# EAGLE schematic arduino_wiring (EAGLE 9.5.2)
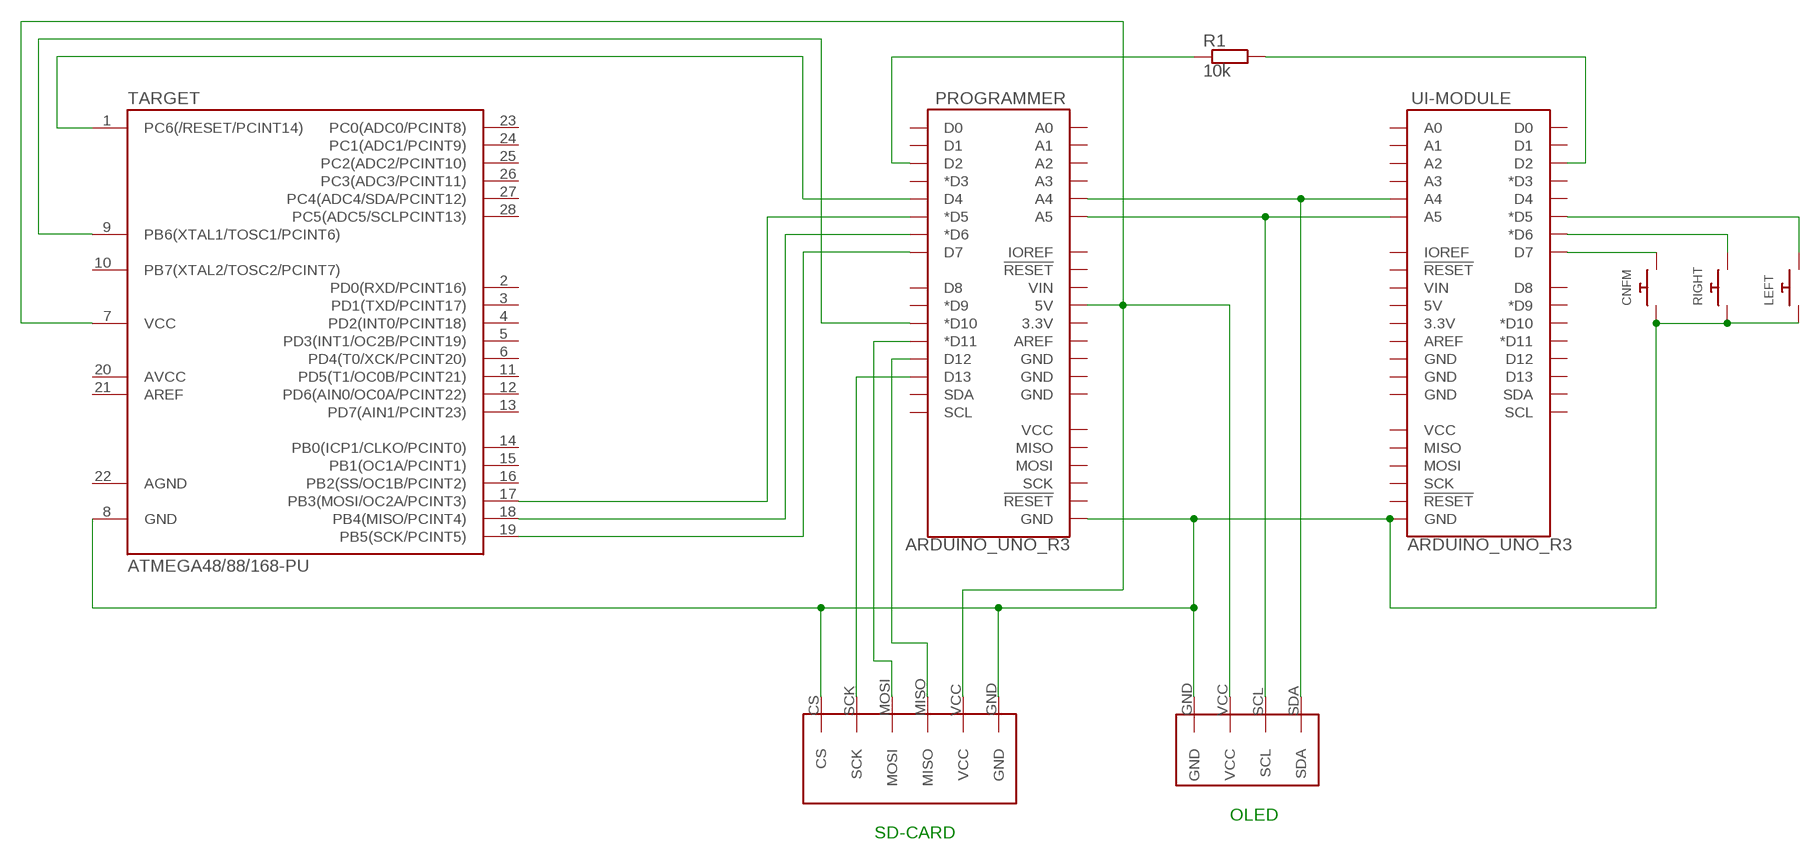
[diagram p0: schematic, sheet 1]

## Parts
CNFM  SWITCH_PUSHBUTTONSOFTTOUCHSMD_SJ  [PUSHBUTTON_SMD_SJ]
LEFT  SWITCH_PUSHBUTTONSOFTTOUCHSMD_SJ  [PUSHBUTTON_SMD_SJ]
PROGRAMMER  ARDUINO_UNO_R3  [ARDUINO_R3]
R1  10k  SMS-0  [SMS-0]
RIGHT  SWITCH_PUSHBUTTONSOFTTOUCHSMD_SJ  [PUSHBUTTON_SMD_SJ]
TARGET  ATMEGA48/88/168-PU  [DIL28-3]
U$1  SD-BREAKOUT  [SD-BREAKOUT]
U$2  128X64-I2C-OLED  [128X64-I2C-OLED]
UI-MODULE  ARDUINO_UNO_R3  [ARDUINO_R3]

## Nets
N$1: PROGRAMMER.D4 TARGET.1(PC6(/RESET/PCINT14))
N$2: PROGRAMMER.D7 TARGET.19(PB5(SCK/PCINT5))
N$3: PROGRAMMER.D6(*D6) TARGET.18(PB4(MISO/PCINT4))
N$4: PROGRAMMER.D5(*D5) TARGET.17(PB3(MOSI/OC2A/PCINT3))
N$5: PROGRAMMER.D10(*D10) TARGET.9(PB6(XTAL1/TOSC1/PCINT6))
N$6: CNFM.P$1 LEFT.P$1 PROGRAMMER.GND@1(GND) RIGHT.P$1 TARGET.8(GND) U$1.CS U$1.GND U$2.GND UI-MODULE.GND@1(GND)
N$7: PROGRAMMER.5V TARGET.7(VCC) U$1.VCC U$2.VCC
N$8: PROGRAMMER.D12 U$1.MISO
N$9: PROGRAMMER.D11(*D11) U$1.MOSI
N$10: PROGRAMMER.D13 U$1.SCK
N$11: PROGRAMMER.D2 R1.2
N$12: R1.1 UI-MODULE.D2
N$13: PROGRAMMER.A5 U$2.SCL UI-MODULE.A5
N$14: PROGRAMMER.A4 U$2.SDA UI-MODULE.A4
N$15: CNFM.P$2 UI-MODULE.D7
N$16: RIGHT.P$2 UI-MODULE.D6(*D6)
N$17: LEFT.P$2 UI-MODULE.D5(*D5)
Unconnected: PROGRAMMER.3.3V PROGRAMMER.A0 PROGRAMMER.A1 PROGRAMMER.A2 PROGRAMMER.A3 PROGRAMMER.AREF PROGRAMMER.D0 PROGRAMMER.D1 PROGRAMMER.D3(*D3) PROGRAMMER.D8 PROGRAMMER.D9(*D9) PROGRAMMER.GND@2(GND) PROGRAMMER.GND@3(GND) PROGRAMMER.GND@4(GND) PROGRAMMER.IOREF PROGRAMMER.MISO PROGRAMMER.MOSI PROGRAMMER.RESET@1(!RESET!) PROGRAMMER.RESET@2(!RESET!) PROGRAMMER.SCK PROGRAMMER.SCL PROGRAMMER.SDA PROGRAMMER.VCC PROGRAMMER.VIN TARGET.2(PD0(RXD/PCINT16)) TARGET.3(PD1(TXD/PCINT17)) TARGET.4(PD2(INT0/PCINT18)) TARGET.5(PD3(INT1/OC2B/PCINT19)) TARGET.6(PD4(T0/XCK/PCINT20)) TARGET.10(PB7(XTAL2/TOSC2/PCINT7)) TARGET.11(PD5(T1/OC0B/PCINT21)) TARGET.12(PD6(AIN0/OC0A/PCINT22)) TARGET.13(PD7(AIN1/PCINT23)) TARGET.14(PB0(ICP1/CLKO/PCINT0)) TARGET.15(PB1(OC1A/PCINT1)) TARGET.16(PB2(SS/OC1B/PCINT2)) TARGET.20(AVCC) TARGET.21(AREF) TARGET.23(PC0(ADC0/PCINT8)) TARGET.24(PC1(ADC1/PCINT9)) TARGET.25(PC2(ADC2/PCINT10)) TARGET.26(PC3(ADC3/PCINT11)) TARGET.27(PC4(ADC4/SDA/PCINT12)) TARGET.28(PC5(ADC5/SCLPCINT13)) UI-MODULE.3.3V UI-MODULE.5V UI-MODULE.A0 UI-MODULE.A1 UI-MODULE.A2 UI-MODULE.A3 UI-MODULE.AREF UI-MODULE.D0 UI-MODULE.D1 UI-MODULE.D3(*D3) UI-MODULE.D4 UI-MODULE.D8 UI-MODULE.D9(*D9) UI-MODULE.D10(*D10) UI-MODULE.D11(*D11) UI-MODULE.D12 UI-MODULE.D13 UI-MODULE.GND@2(GND) UI-MODULE.GND@3(GND) UI-MODULE.GND@4(GND) UI-MODULE.IOREF UI-MODULE.MISO UI-MODULE.MOSI UI-MODULE.RESET@1(!RESET!) UI-MODULE.RESET@2(!RESET!) UI-MODULE.SCK UI-MODULE.SCL UI-MODULE.SDA UI-MODULE.VCC UI-MODULE.VIN

## Notes on the sheet
- OLED
- SD-CARD

## Power pins joined to a net without a drawn wire
AGND: TARGET.22(AGND)

## Library data of the parts
CNFM LEFT RIGHT = adafruit:SWITCH_PUSHBUTTON: Buttons SOFTTOUCHSMD_SJ - Soft touch temporary push button (Super Junk Akihabara) Compatible with SKPMANE010 [Mouser: 688-SKPMAN] C&K_KSS = Digikey: KSS221GLFS
PROGRAMMER UI-MODULE = SparkFun-Boards:ARDUINO_UNO_R3: Arduino R3 Footprint with SPI header Arduino Uno R3 Compatible Footprint. Matches PCB size of the original board. SparkFun Products: SAMD21 Dev Breakout <https://www.sparkfun.com/products/13672> RedBoard <https://www.sparkfun.com/products/12757> R3 Stackable Headers <https://www.sparkfun.com/products/11417>
R1 = resistor-shunt:SMS-0: SMD SHUNT RESISTOR; OC_FARNELL: unknown; OC_NEWARK: unknown
TARGET = atmega8:ATMEGA48/88/168-PU
U$1 = Parts:SD-BREAKOUT
U$2 = Parts:128X64-I2C-OLED

## Module SD-BREAKOUT
Ports: 

### Library data of the parts